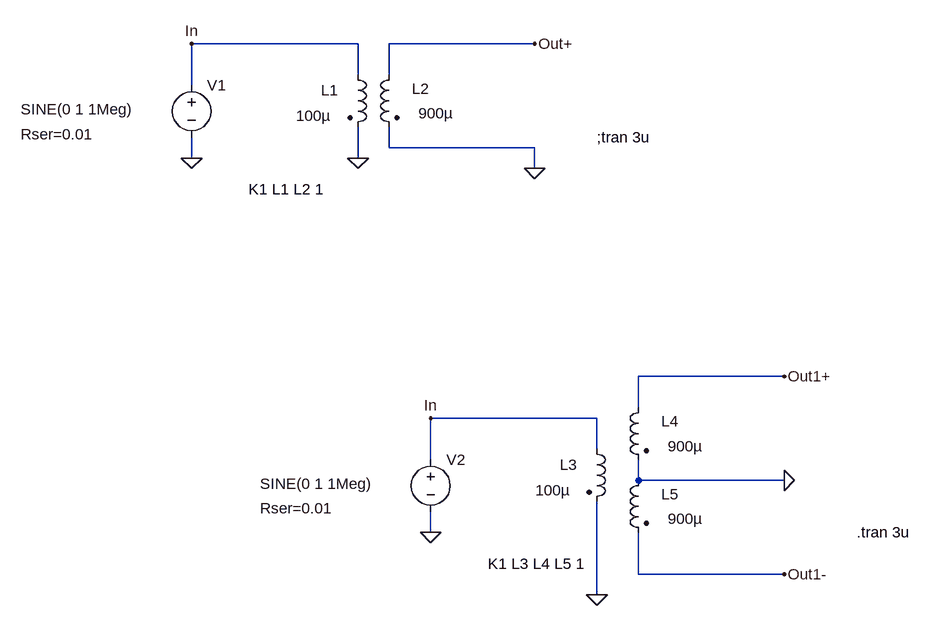
[diagram p0: schematic AC Power Flow ver 1.0.asc]
AC Power Flow ver 1.0.asc, the LTspice schematic file:
Version 4
SHEET 1 880 680
WIRE -672 -528 -928 -528
WIRE -400 -528 -624 -528
WIRE -672 -480 -672 -528
WIRE -624 -480 -624 -528
WIRE -928 -464 -928 -528
WIRE -624 -368 -624 -400
WIRE -400 -368 -624 -368
WIRE -928 -352 -928 -384
WIRE -672 -352 -672 -400
WIRE -400 -336 -400 -368
WIRE -16 -16 -240 -16
WIRE -240 32 -240 -16
WIRE -304 48 -560 48
WIRE -304 96 -304 48
WIRE -560 112 -560 48
WIRE -240 144 -240 112
WIRE -16 144 -240 144
WIRE -560 224 -560 192
WIRE -240 288 -240 224
WIRE -16 288 -240 288
WIRE -304 320 -304 176
FLAG -928 -352 0
FLAG -672 -352 0
FLAG -400 -528 Out+
FLAG -928 -528 In
FLAG -400 -336 0
FLAG -560 224 0
FLAG -304 320 0
FLAG -16 -16 Out1+
FLAG -560 48 In
FLAG -16 144 0
FLAG -16 288 Out1-
SYMBOL ind2 -688 -496 R0
WINDOW 0 -41 40 Left 2
WINDOW 3 -79 79 Left 2
SYMATTR InstName L1
SYMATTR Value 100µ
SYMATTR Type ind
SYMBOL ind2 -608 -496 M0
WINDOW 0 -46 37 Left 2
WINDOW 3 -83 75 Left 2
SYMATTR InstName L2
SYMATTR Value 900µ
SYMATTR Type ind
SYMBOL voltage -928 -480 R0
WINDOW 3 -263 53 Left 2
WINDOW 123 0 0 Left 2
WINDOW 39 -263 91 Left 2
SYMATTR InstName V1
SYMATTR Value SINE(0 1 1Meg)
SYMATTR SpiceLine Rser=0.01
SYMBOL ind2 -320 80 R0
WINDOW 0 -41 40 Left 2
WINDOW 3 -79 79 Left 2
SYMATTR InstName L3
SYMATTR Value 100µ
SYMATTR Type ind
SYMATTR SpiceLine Rser=0.01
SYMBOL ind2 -224 16 M0
WINDOW 0 -46 37 Left 2
WINDOW 3 -83 75 Left 2
SYMATTR InstName L4
SYMATTR Value 900µ
SYMATTR Type ind
SYMATTR SpiceLine Rser=.01
SYMBOL voltage -560 96 R0
WINDOW 3 -263 53 Left 2
WINDOW 123 0 0 Left 2
WINDOW 39 -263 91 Left 2
SYMATTR InstName V2
SYMATTR Value SINE(0 1 1Meg)
SYMATTR SpiceLine Rser=0.01
SYMBOL ind2 -224 128 M0
WINDOW 0 -46 37 Left 2
WINDOW 3 -83 75 Left 2
SYMATTR InstName L5
SYMATTR Value 900µ
SYMATTR Type ind
SYMATTR SpiceLine Rser=0.01
TEXT -840 -304 Left 2 !K1 L1 L2 1
TEXT -304 -384 Left 2 !;tran 3u
TEXT -472 272 Left 2 !K1 L3 L4 L5 1
TEXT 96 224 Left 2 !.tran 3u

The netlist it stands for:
* AC Power Flow ver 1.0.asc
L1 In 0 100µ
L2 Out+ 0 900µ
V1 In 0 SINE(0 1 1Meg) Rser=0.01
L3 In 0 100µ Rser=0.01
L4 Out1+ 0 900µ Rser=.01
V2 In 0 SINE(0 1 1Meg) Rser=0.01
L5 0 Out1- 900µ Rser=0.01
K1 L1 L2 1
;tran 3u
K1 L3 L4 L5 1
.tran 3u
.backanno
.end